# Altium project mini-rockets.PrjPcb (part 1 of 2)
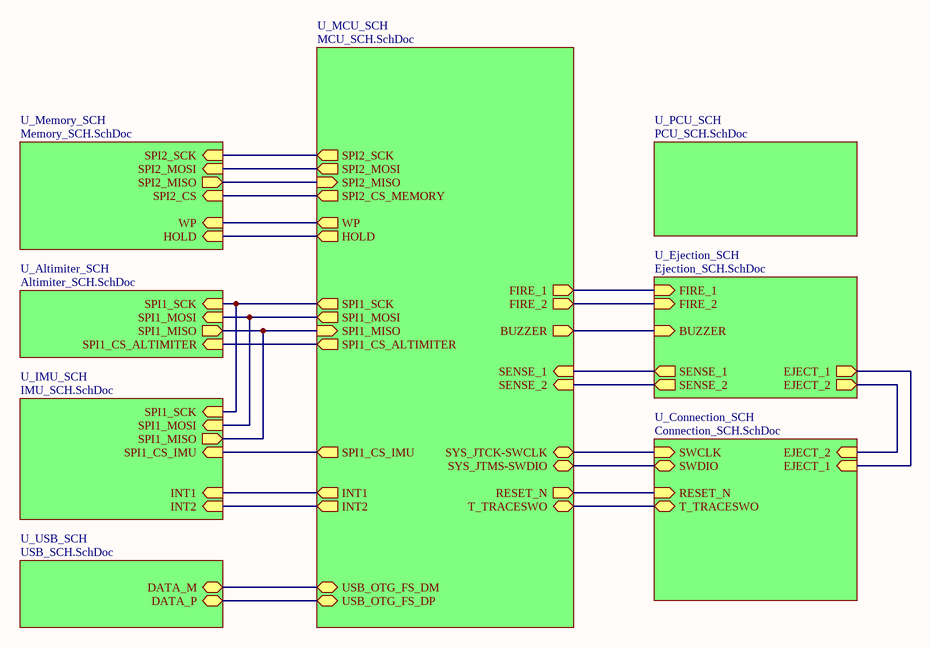
[diagram p0: TopLevel.SchDoc]
9 sheets, 83 parts. Net scope: hierarchical (ports join the sheet entries above them; power ports are global).
Board file: mini-rocket.PcbDoc
Sheets:
  TopLevel.SchDoc
    U_Altimiter_SCH = Altimiter_SCH.SchDoc
    U_MCU_SCH = MCU_SCH.SchDoc
    U_Connection_SCH = Connection_SCH.SchDoc
    U_Memory_SCH = Memory_SCH.SchDoc
    U_PCU_SCH = PCU_SCH.SchDoc
    U_Ejection_SCH = Ejection_SCH.SchDoc
    U_IMU_SCH = IMU_SCH.SchDoc
    U_USB_SCH = USB_SCH.SchDoc

## Sheet TopLevel.SchDoc
size A; SheetNumber: 1; SheetTotal: 8

### Sub-sheets
U_Altimiter_SCH = Altimiter_SCH.SchDoc: SPI1_SCK (in), SPI1_MOSI (in), SPI1_MISO (out), SPI1_CS_ALTIMITER (in)
U_Connection_SCH = Connection_SCH.SchDoc: SWCLK (in), SWDIO (bidir), T_TRACESWO (bidir), RESET_N (in), EJECT_1 (in), EJECT_2 (in)
U_Ejection_SCH = Ejection_SCH.SchDoc: SENSE_1 (out), SENSE_2 (out), EJECT_1 (out), EJECT_2 (out), FIRE_1 (in), FIRE_2 (in), BUZZER (in)
U_IMU_SCH = IMU_SCH.SchDoc: SPI1_MOSI (in), SPI1_MISO (out), SPI1_CS_IMU (in), SPI1_SCK (in), INT2 (in), INT1 (in)
U_MCU_SCH = MCU_SCH.SchDoc: RESET_N (out), USB_OTG_FS_DM (bidir), USB_OTG_FS_DP (bidir), SYS_JTMS-SWDIO (bidir), SYS_JTCK-SWCLK (bidir), SPI2_SCK (out), SPI2_MISO (in), SPI2_MOSI (out), SPI1_SCK (out), SPI1_MISO (in), SPI1_MOSI (out), WP (out), HOLD (out), INT1 (out), INT2 (out), FIRE_1 (out), FIRE_2 (out), SENSE_1 (in), SENSE_2 (in), SPI2_CS_MEMORY (out), T_TRACESWO (bidir), SPI1_CS_ALTIMITER (out), SPI1_CS_IMU (out), BUZZER (out)
U_Memory_SCH = Memory_SCH.SchDoc: SPI2_SCK (in), WP (in), HOLD (in), SPI2_MOSI (in), SPI2_MISO (out), SPI2_CS (in)
U_PCU_SCH = PCU_SCH.SchDoc: no entries
U_USB_SCH = USB_SCH.SchDoc: DATA_M (bidir), DATA_P (bidir)

### Nets
BUZZER: sheet U_MCU_SCH/BUZZER, sheet U_Ejection_SCH/BUZZER
D_N: sheet U_MCU_SCH/USB_OTG_FS_DM, sheet U_USB_SCH/DATA_M
D_P: sheet U_MCU_SCH/USB_OTG_FS_DP, sheet U_USB_SCH/DATA_P
EJECT_1: sheet U_Connection_SCH/EJECT_1, sheet U_Ejection_SCH/EJECT_1
EJECT_2: sheet U_Connection_SCH/EJECT_2, sheet U_Ejection_SCH/EJECT_2
FIRE_1: sheet U_MCU_SCH/FIRE_1, sheet U_Ejection_SCH/FIRE_1
FIRE_2: sheet U_MCU_SCH/FIRE_2, sheet U_Ejection_SCH/FIRE_2
HOLD: sheet U_MCU_SCH/HOLD, sheet U_Memory_SCH/HOLD
INT1: sheet U_MCU_SCH/INT1, sheet U_IMU_SCH/INT1
INT2: sheet U_MCU_SCH/INT2, sheet U_IMU_SCH/INT2
RESET_N: sheet U_MCU_SCH/RESET_N, sheet U_Connection_SCH/RESET_N
SENSE_1: sheet U_MCU_SCH/SENSE_1, sheet U_Ejection_SCH/SENSE_1
SENSE_2: sheet U_MCU_SCH/SENSE_2, sheet U_Ejection_SCH/SENSE_2
SPI1_CS_ALTIMITER: sheet U_Altimiter_SCH/SPI1_CS_ALTIMITER, sheet U_MCU_SCH/SPI1_CS_ALTIMITER
SPI1_CS_IMU: sheet U_MCU_SCH/SPI1_CS_IMU, sheet U_IMU_SCH/SPI1_CS_IMU
SPI1_MISO: sheet U_Altimiter_SCH/SPI1_MISO, sheet U_MCU_SCH/SPI1_MISO, sheet U_IMU_SCH/SPI1_MISO
SPI1_MOSI: sheet U_Altimiter_SCH/SPI1_MOSI, sheet U_MCU_SCH/SPI1_MOSI, sheet U_IMU_SCH/SPI1_MOSI
SPI1_SCK: sheet U_Altimiter_SCH/SPI1_SCK, sheet U_MCU_SCH/SPI1_SCK, sheet U_IMU_SCH/SPI1_SCK
SPI2_CS: sheet U_MCU_SCH/SPI2_CS_MEMORY, sheet U_Memory_SCH/SPI2_CS
SPI2_MISO: sheet U_MCU_SCH/SPI2_MISO, sheet U_Memory_SCH/SPI2_MISO
SPI2_MOSI: sheet U_MCU_SCH/SPI2_MOSI, sheet U_Memory_SCH/SPI2_MOSI
SPI2_SCK: sheet U_MCU_SCH/SPI2_SCK, sheet U_Memory_SCH/SPI2_SCK
SWCLK: sheet U_MCU_SCH/SYS_JTCK-SWCLK, sheet U_Connection_SCH/SWCLK
SWDIO: sheet U_MCU_SCH/SYS_JTMS-SWDIO, sheet U_Connection_SCH/SWDIO
T_TRACESWO: sheet U_MCU_SCH/T_TRACESWO, sheet U_Connection_SCH/T_TRACESWO
WP: sheet U_MCU_SCH/WP, sheet U_Memory_SCH/WP

## Sheet Altimiter_SCH.SchDoc
size A; SheetNumber: 5; SheetTotal: 9
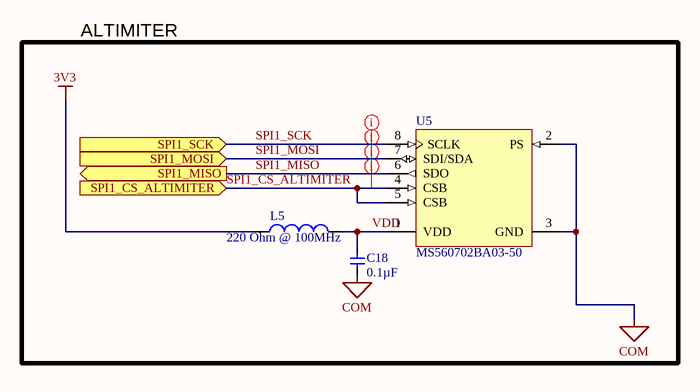
[diagram p1: Altimiter_SCH.SchDoc]

### Parts
C18  Capacitance: 0.1µF  [C0603]  (hidden comment: GRM188R71C104KA01D)
L5  Impedance @ Frequency: 220 Ohm @ 100MHz  [L0805]  (hidden comment: BLM21PG221SN1D)
U5  MS560702BA03-50  [TECO-MS560702BA03-50_V]

### Blocks framed on the sheet
ALTIMITER: C18 L5 U5

### Ports
SPI1_CS_ALTIMITER (in), SPI1_MISO (out), SPI1_MOSI (in), SPI1_SCK (in)

### Nets
3V3: L5.1
COM: C18.2 U5.2(PS) U5.3(GND)
SPI1_CS_ALTIMITER: U5.4(CSB) U5.5(CSB) ; port SPI1_CS_ALTIMITER
SPI1_MISO: U5.6(SDO) ; port SPI1_MISO
SPI1_MOSI: U5.7(SDI/SDA) ; port SPI1_MOSI
SPI1_SCK: U5.8(SCLK) ; port SPI1_SCK
VDD: C18.1 L5.2 U5.1(VDD)

### Layout directives
net class 50_Ohm: SPI1_CS_ALTIMITER, SPI1_MISO, SPI1_MOSI, SPI1_SCK

### Library data of the parts
C18 = GRM188R71C104KA01D: CAP CER 0.1UF 16V 10% X7R 0603; ComponentLink1Description: Datasheet; ComponentLink1URL: http://search.murata.co.jp/Ceramy/image/img/A01X/G101/ENG/GRM188R71C104KA01-01.pdf; ComponentLink2URL: http://media.digikey.com/photos/Murata%20Photos/0603%20Murata%20MLCC%20Caps.jpg; ComponentLink2Description: Photo; Pricing 1: 1=0.13 (USD); Tolerance: ±10%; Operating Temperature: -55°C ~ 125°C; Applications: General Purpose; Supplier 1: Digi-Key; Supplier Part Number 1: 490-1532-1-ND; Temperature Coefficient: X7R; Voltage - Rated: 16V
L5 = BLM21PG221SN1D: FERRITE CHIP 220 OHM 0805; Current Rating: 2A; DC Resistance (DCR): 45 mOhm Max; Filter Type: Differential Mode - Single; Supplier 1: Digi-Key; Supplier Part Number 1: 490-1054-1-ND; ComponentLink1URL: http://search.murata.co.jp/Ceramy/image/img/PDF/ENG/L0110S0100BLM21P.pdf; ComponentLink1Description: datasheet; ComponentLink2URL: http://media.digikey.com/photos/Murata%20Photos/BLM21%20SERIES%200805.jpg; ComponentLink2Description: photo
U5 = CMP-2000-07512-1: Barometric Pressure Sensor, with Stainless Steel Cap , 1.8 to 3.6 V, -40 to 85 degC, 8-Pin SMD, RoHS, Tape and Reel; Manufacturer: TE Connectivity; Lead Free: LeadFree; RoHSCompliant: false; Mounting Technology: SurfaceMount; Datasheet URL: http://www.te.com/commerce/DocumentDelivery/DDEController?Action=showdoc&DocId=Data+Sheet%7FMS5607-02BA03%7FB2%7Fpdf%7FEnglish%7FENG_DS_MS5607-02BA03_B2.pdf%7FMS560702BA03-50; Manufacturer URL: http://www.te.com/; Package Description: 8-Pin Surface Mount Device, Body 3 x 5 mm, Pitch 1.25 mm; Package Reference: MS560702BA03-50; Datasheet Version: 06/2017

## Sheet MCU_SCH.SchDoc
size B; SheetNumber: 3; SheetTotal: 9; SPICEModelCacheGSGSOODR: <root> / <DocumentId>GSGSOODR</DocumentId> / <CacheFrame Number="0"> / <Model Name="lmk107b7225_a-tr" Kind="CKT"> / <Text>* LMK107B7225_A-TR     SPICE MODEL  ( General Type ) / *-------------------------------------------------------------------------------------------------------- / * Model Generated by TAIYO YUDEN Corporation (http://www.ty-top.com) / * Version 1.0 / * TAIYO YUDEN Control No. 170508_100817 / * Copyright(c) 2012 TAIYO YUDEN CO.,LTD. All Rights Reserved. / *-------------------------------------------------------------------------------------------------------- / * / * Products Name : Multilayer Ceramic Capacitors / * / * Characteristics : / *     Capacitance : 2.2 uF , Rated Voltage : 10V , TCC : X7R / *     Case Size : 1.6 x 0.8 / 0.063 x 0.031 [mm/inch] , Thickness : 0.8 / 0.031 [mm/inch] / *     (Conditions: Temperature = 25 degC , DC Bias Current/Voltage = 0A / 0V) / * / * Frequency Range : 40Hz - 3GHz / * / * External Node Assignments : / * / *  1  o---| |---o  2 / * / *-------------------------------------------------------------------------------------------------------- / .SubCkt LMK107B7225_A-TR 1 2 / **************************** / C0 1 110 1.6448u / Cm 1 101 0.35593u / C1 101 102 0.58122u / Rc1 101 102 1.399k / C2 102 103 0.16803u / Rc2 102 103 145.45 / C3 103 110 0.093029u / Rc3 103 110 10.174 / C2m 1 301 0.50048u / C21 301 302 1.5848u / Rc21 301 302 3.55k / C22 302 303 1.5193u / Rc22 302 303 3.3641k / C23 303 304 2.179u / Rc23 303 304 2.1549k / C24 304 305 0.86851u / Rc24 304 305 215.54 / C25 305 306 0.87682u / Rc25 305 306 159.72 / C26 306 307 1.7101u / Rc26 306 307 4.7719 / C27 307 308 0.6214u / Rc27 307 308 12.394 / C28 308 309 0.643u / Rc28 308 309 10.101 / C29 309 110 5422p / Rc29 309 110 0.99109 / Rp0 1 110 45.4545454545455Meg / L0 110 120 0.23321n / Lm 120 130 0.16586n / L1 120 121 0.12676n / RL1 121 130 86.335m / L2 120 122 0.61599n / RL2 122 130 0.38949 / L3 120 123 0.67084n / RL3 123 130 0.43251 / CR 120 124 0.12415u / LR 124 125 0.46265n / RR 125 130 72.926m / CL 130 140 1.3749p / LL 130 140 0.23217n / RL 130 140 32.536 / Rs 140 2 6.8187m / **************************** / .ends LMK107B7225_A-TR</Text> / </Model> / </CacheFrame> / </root>
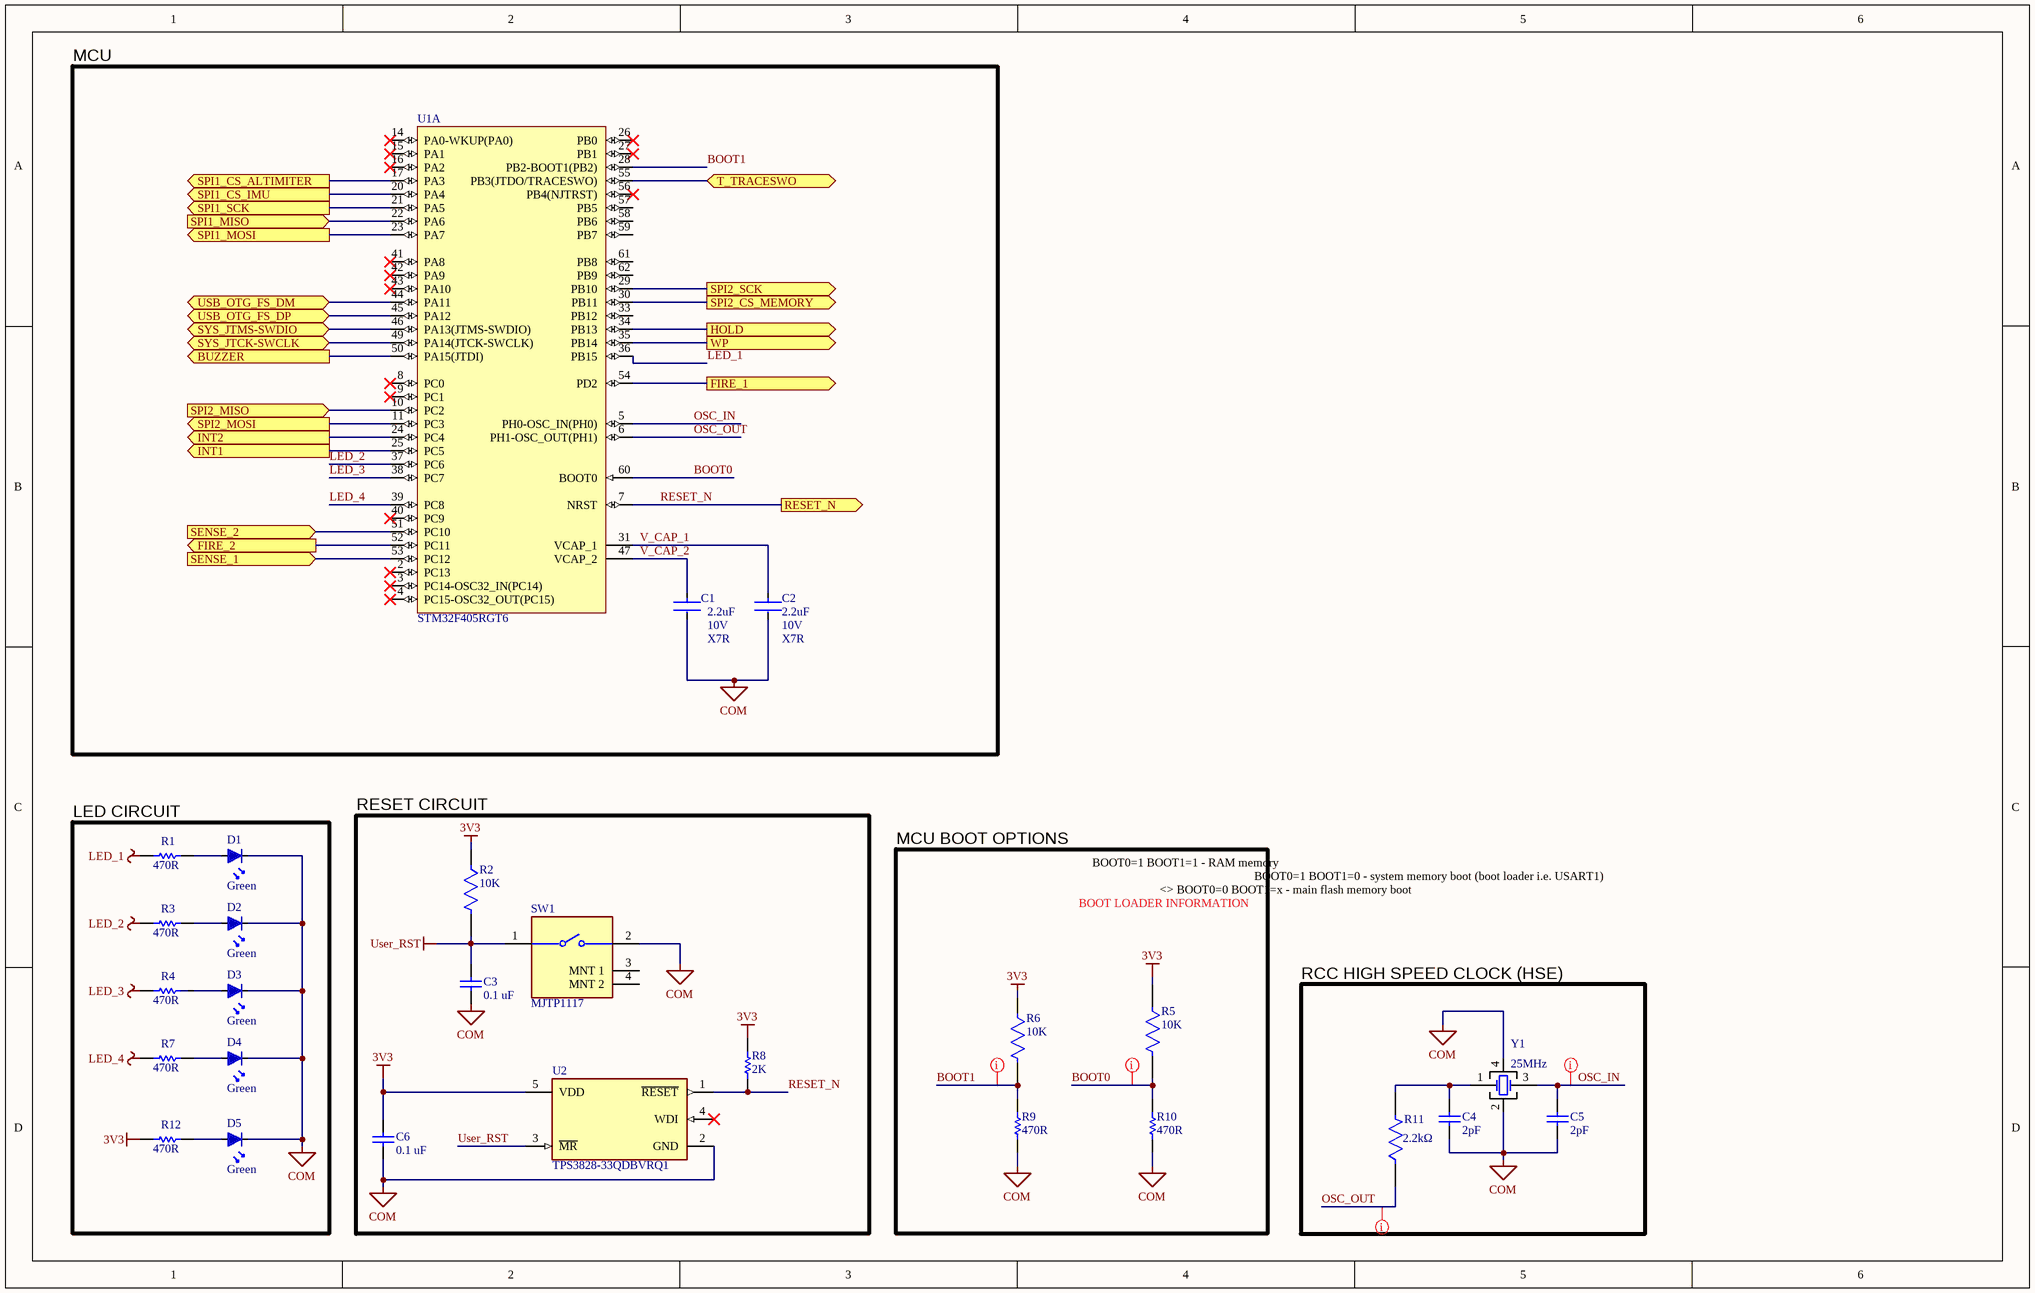
[diagram p2: MCU_SCH.SchDoc]

### Parts
C1  Dielectric: X7R  Voltage Rating: 10V  Capacitance: 2.2uF  [FP-0603-L_1_6_0_1-W_0_8_0-IPC_C]  (hidden comment: LMK107B7225KA-TR)
C2  Dielectric: X7R  Voltage Rating: 10V  Capacitance: 2.2uF  [FP-0603-L_1_6_0_1-W_0_8_0-IPC_C]  (hidden comment: LMK107B7225KA-TR)
C3  0.1 uF  [MURA-0603_H_0.9_M]
C4  2pF  [CAPC1608X92X38LL15T08]
C5  2pF  [CAPC1608X92X38LL15T08]
C6  0.1 uF  [MURA-0603_H_0.9_M]
D1  Color: Green  [D0805]  (hidden comment: SML-LXR85GC-TR)
D2  Color: Green  [D0805]  (hidden comment: SML-LXR85GC-TR)
D3  Color: Green  [D0805]  (hidden comment: SML-LXR85GC-TR)
D4  Color: Green  [D0805]  (hidden comment: SML-LXR85GC-TR)
D5  Color: Green  [D0805]  (hidden comment: SML-LXR85GC-TR)
R1  470R  [RESC1608X55X30NL15T15]
R2  10K  [FP-ERJ3G-IPC_C]
R3  470R  [RESC1608X55X30NL15T15]
R4  470R  [RESC1608X55X30NL15T15]
R5  10K  [FP-ERJ3G-IPC_C]
R6  10K  [FP-ERJ3G-IPC_C]
R7  470R  [RESC1608X55X30NL15T15]
R8  2K  [RESC1608X55X30LL15T15]
R9  470R  [RESC1608X55X30NL15T15]
R10  470R  [RESC1608X55X30NL15T15]
R11  Resistance: 2.2kΩ  [FP-ERJ3G-MFG]  (hidden comment: ERJ-3GEYJ222V)
R12  470R  [RESC1608X55X30NL15T15]
SW1  MJTP1117  [FP-MJTP1117-MFG]
U1  STM32F405RGT6  [STM-LQFP64_M]  (part A of 2)
U2  TPS3828-33QDBVRQ1  [FP-DBV0005A-IPC_C]
Y1  Frequency: 25MHz  [ECS - 4-SMD, No Lead]  (hidden comment: 490-18333-1-ND)

### Blocks framed on the sheet
MCU: C1 C2 U1
LED CIRCUIT: D1-D5 R1 R3 R4 R7 R12
RESET CIRCUIT: C3 C6 R2 R8 SW1 U2
MCU BOOT OPTIONS: R5 R6 R9 R10
RCC HIGH SPEED CLOCK (HSE): C4 C5 R11 Y1

### Ports
BUZZER (out), FIRE_1 (out), FIRE_2 (out), HOLD (out), INT1 (out), INT2 (out), RESET_N (out), SENSE_1 (in), SENSE_2 (in), SPI1_CS_ALTIMITER (out), SPI1_CS_IMU (out), SPI1_MISO (in), SPI1_MOSI (out), SPI1_SCK (out), SPI2_CS_MEMORY (out), SPI2_MISO (in), SPI2_MOSI (out), SPI2_SCK (out), SYS_JTCK-SWCLK (bidir), SYS_JTMS-SWDIO (bidir), T_TRACESWO (bidir), USB_OTG_FS_DM (bidir), USB_OTG_FS_DP (bidir), WP (out)

### Nets
3V3: C6.2 R2.1 R5.1 R6.1 R8.2 R12.1 U2.5(VDD)
COM: C1.2 C2.2 C3.1 C4.2 C5.2 C6.1 D1.K D2.K D3.K D4.K D5.K R9.1 R10.1 SW1.2 U2.2(GND) Y1.2 Y1.4
LED_1: R1.1 U1.36(PB15)
LED_2: R3.1 U1.37(PC6)
LED_3: R4.1 U1.38(PC7)
LED_4: R7.1 U1.39(PC8)
User_RST: C3.2 R2.2 SW1.1 U2.3(~{MR})
BOOT0: R5.2 R10.2 U1.60(BOOT0)
BOOT1: R6.2 R9.2 U1.28(PB2-BOOT1(PB2))
BUZZER: U1.50(PA15(JTDI)) ; port BUZZER
D_N: U1.44(PA11) ; port USB_OTG_FS_DM
D_P: U1.45(PA12) ; port USB_OTG_FS_DP
FIRE_1: U1.54(PD2) ; port FIRE_1
FIRE_2: U1.52(PC11) ; port FIRE_2
HOLD: U1.34(PB13) ; port HOLD
INT1: U1.25(PC5) ; port INT1
INT2: U1.24(PC4) ; port INT2
OSC_IN: C5.1 U1.5(PH0-OSC_IN(PH0)) Y1.3(OSC2)
OSC_OUT: R11.1 U1.6(PH1-OSC_OUT(PH1))
RESET_N: R8.1 U1.7(NRST) U2.1(~{RESET}) ; port RESET_N
SENSE_1: U1.53(PC12) ; port SENSE_1
SENSE_2: U1.51(PC10) ; port SENSE_2
SPI1_CS_ALTIMITER: U1.17(PA3) ; port SPI1_CS_ALTIMITER
SPI1_CS_IMU: U1.20(PA4) ; port SPI1_CS_IMU
SPI1_MISO: U1.22(PA6) ; port SPI1_MISO
SPI1_MOSI: U1.23(PA7) ; port SPI1_MOSI
SPI1_SCK: U1.21(PA5) ; port SPI1_SCK
SPI2_CS: U1.30(PB11) ; port SPI2_CS_MEMORY
SPI2_MISO: U1.10(PC2) ; port SPI2_MISO
SPI2_MOSI: U1.11(PC3) ; port SPI2_MOSI
SPI2_SCK: U1.29(PB10) ; port SPI2_SCK
SWCLK: U1.49(PA14(JTCK-SWCLK)) ; port SYS_JTCK-SWCLK
SWDIO: U1.46(PA13(JTMS-SWDIO)) ; port SYS_JTMS-SWDIO
T_TRACESWO: U1.55(PB3(JTDO/TRACESWO)) ; port T_TRACESWO
V_CAP_1: C2.1 U1.31(VCAP_1)
V_CAP_2: C1.1 U1.47(VCAP_2)
WP: U1.35(PB14) ; port WP
NetC4_1: C4.1 R11.2 Y1.1(OSC1)
NetD1_A: D1.A R1.2
NetD2_A: D2.A R3.2
NetD3_A: D3.A R4.2
NetD4_A: D4.A R7.2
NetD5_A: D5.A R12.2

Not connected (* = marked no-connect by the designer): SW1 3(MNT_1) 4(MNT_2); U1 2(PC13)* 3(PC14-OSC32_IN(PC14))* 4(PC15-OSC32_OUT(PC15))* 8(PC0)* 9(PC1)* 14(PA0-WKUP(PA0))* 15(PA1)* 16(PA2)* 26(PB0)* 27(PB1)* 33(PB12) 40(PC9)* 41(PA8)* 42(PA9)* 43(PA10)* 56(PB4(NJTRST))* 57(PB5) 58(PB6) 59(PB7) 61(PB8) 62(PB9); U2 4(WDI)*

### Layout directives
net class 50_Ohm: BOOT0, BOOT1, OSC_IN, OSC_OUT

### Notes on the sheet
- BOOT LOADER INFORMATION
- BOOT0=1 BOOT1=1 - RAM memory
- <> BOOT0=0 BOOT1=x - main flash memory boot
- BOOT0=1 BOOT1=0 - system memory boot (boot loader i.e. USART1)

### Library data of the parts
C1 = CMP-14477-000474-2: CAP CER 2.2UF 10V X7R 0603; Tolerance: 10%; RoHS Compliant: Yes; Min Operating Temperature: -55°C; Width: 0.031inch; Packaging: Tape and Reel; Termination: Wraparound; Case/Package: 0603; Halogen Free: Halogen Free; Mount: Surface Mount; Thickness: 0.035inch; Length: 0.063inch; Voltage Rating (DC): 10V; Max Operating Temperature: 125°C
C2 = CMP-14477-000474-2: None; Tolerance: 10%; RoHS Compliant: Yes; Min Operating Temperature: -55°C; Width: 0.031inch; Packaging: Tape and Reel; Termination: Wraparound; Case/Package: 0603; Halogen Free: Halogen Free; Mount: Surface Mount; Thickness: 0.035inch; Length: 0.063inch; Voltage Rating (DC): 10V; Max Operating Temperature: 125°C
C3 = CMP-2000-05253-1: CAP, Ceramic, 0.1 uF, 10%, 16 V, 0603, RoHS, Tape and Reel; Manufacturer: Murata; Capacitance - pF: 100000pF; Case Length: 1.6mm; Voltage Rating DC: 16V; Brand: MurataElectronics; Temperature Coefficient / Code: +/-15%; Case Width: 0.8mm; Type: GeneralPurposeMLCC; Capacitance: 0.1uF; Dielectric: X7R; Capacitance - nF: 100nF; Product Category: MultilayerCeramicCapacitorsMLCC-SMD/SMT; Datasheet URL: https://datasheet.ciiva.com/29202/451467-da-01-en-vs-kondensator-0603-29202287.pdf; Termination Style: SMD/SMT; Operating Temperature Range: -55Cto+125C; Case Code - in: 0603; Datasheet Version: Dec-10; Dimensions: 0.8mmWx1.6mmLx0.8mmH; RoHS: Details; Case Code - mm: 1608; Product: GeneralTypeMLCCs; Voltage Rating: 16V; Package / Case: 0603(1608metric); Factory Pack Quantity: 4000; Packaging: Reel; Maximum Operating Temperature: +125C; Manufacturer URL: http://www.murata.com/; Case Height: 0.8mm; Minimum Operating Temperature: -55C; Series: GRM; Tolerance: 10%
C4 C5 = CMP-2006-01521-1: VJ0603D471KXXAJ CAP CER 2PF 50V C0G/NP0 0603; Manufacturer: Vitramon; Part Number: VJ0603D471KXXAJ
C6 = CMP-2000-05253-1: CAP, Ceramic, 0.1 uF, 10%, 16 V, 0603, RoHS, Tape and ReelGRM188R71C104KA01D / Replaced by:  C0603C104K4RAC7081; Manufacturer: Murata; Capacitance - pF: 100000pF; Case Length: 1.6mm; Voltage Rating DC: 16V; Brand: MurataElectronics; Temperature Coefficient / Code: +/-15%; Case Width: 0.8mm; Type: GeneralPurposeMLCC; Capacitance: 0.1uF; Dielectric: X7R; Capacitance - nF: 100nF; Product Category: MultilayerCeramicCapacitorsMLCC-SMD/SMT; Datasheet URL: https://datasheet.ciiva.com/29202/451467-da-01-en-vs-kondensator-0603-29202287.pdf; Termination Style: SMD/SMT; Operating Temperature Range: -55Cto+125C; Case Code - in: 0603; Datasheet Version: Dec-10; Dimensions: 0.8mmWx1.6mmLx0.8mmH; RoHS: Details; Case Code - mm: 1608; Product: GeneralTypeMLCCs; Voltage Rating: 16V; Package / Case: 0603(1608metric); Factory Pack Quantity: 4000; Packaging: Reel; Maximum Operating Temperature: +125C; Manufacturer URL: http://www.murata.com/; Case Height: 0.8mm; Minimum Operating Temperature: -55C; Series: GRM; Tolerance: 10%
D1-D5 = SML-LXR85GC-TR: LED RA 565NM GREEN WTR CLR SMD 0805; Voltage - DC Reverse (Vr) (Max): 5V; Voltage - Forward (Vf) (Typ): 2.2V; Current - Test: 20mA; Viewing Angle: 130°; Millicandela Rating: 12mcd; Lens Style/Size: Rectangle with Domed Top; Lens Color: Colorless; Lens Transparency: Clear; ComponentLink1Description: Datasheet; ComponentLink1URL: http://www.lumex.com/specs/SML-LXR85GC-TR.pdf; ComponentLink2URL: http://media.digikey.com/photos/Lumex%20Photos/Fig%2012%20T052%201546.jpg; ComponentLink2Description: Photo; Wavelength - Peak: 565nm; Supplier 1: Digi-Key; Supplier Part Number 1: 67-1557-1-ND
R1 = CMP-2000-00795-1: 470 Ohm ERJ-3GEYJ471V; Manufacturer: Panasonic; Part Number: ERJ-3GEYJ471V
R2 = CMP-2000-00704-2: RES SMD 10K OHM 5% 1/10W 0603; Temperature Coefficient: 200ppm/°C; Max Power Dissipation: 100mW; Resistance: 10kR; Voltage Rating (DC): 50V; Voltage Rating: 75V; Resistor Type: Thick Film; Tolerance: 5%; Military Standard: Not; Package Quantity: 1; Max Operating Temperature: 155°C; Mount: Surface Mount; Technology: THICK FILM; Case/Package: 0603; Construction: Rectangular; Depth: 0.8mm; Case Code (Imperial): 0603; Weight: 7.1E-05oz; Features: Automotive AEC-Q200; Packaging: Tape and Reel; Width: 0.8mm; Length: 1.6mm; Termination: SMD/SMT; Power Rating: 100mW; Lead Free: Lead Free; Number of Terminations: 2; Height: 0.45mm; RoHS Compliant: Yes; Min Operating Temperature: -55°C; Contact Plating: Tin; REACH SVHC: No SVHC; Resistance Tolerance: 5%; Series: ERJ; Working Voltage: 75V; Case Code (Metric): 1608
R3 R4 R7 R9 R10 R12 = CMP-2000-00795-1: ERJ-3GEYJ471V; Manufacturer: Panasonic; Part Number: ERJ-3GEYJ471V
R5 R6 = CMP-2000-00704-2: RES SMD 10K OHM 5% 1/10W 0603 ERJ-3GEYJ103V; Temperature Coefficient: 200ppm/°C; Max Power Dissipation: 100mW; Resistance: 10kR; Voltage Rating (DC): 50V; Voltage Rating: 75V; Resistor Type: Thick Film; Tolerance: 5%; Military Standard: Not; Package Quantity: 1; Max Operating Temperature: 155°C; Mount: Surface Mount; Technology: THICK FILM; Case/Package: 0603; Construction: Rectangular; Depth: 0.8mm; Case Code (Imperial): 0603; Weight: 7.1E-05oz; Features: Automotive AEC-Q200; Packaging: Tape and Reel; Width: 0.8mm; Length: 1.6mm; Termination: SMD/SMT; Power Rating: 100mW; Lead Free: Lead Free; Number of Terminations: 2; Height: 0.45mm; RoHS Compliant: Yes; Min Operating Temperature: -55°C; Contact Plating: Tin; REACH SVHC: No SVHC; Resistance Tolerance: 5%; Series: ERJ; Working Voltage: 75V; Case Code (Metric): 1608
R8 = CMP-2000-00741-1: ERJ-3GEYJ202V; Manufacturer: Panasonic; Part Number: ERJ-3GEYJ202V
R11 = CMP-2000-00747-2: RES SMD 2.2K OHM 5% 1/10W 0603; Manufacturer: Panasonic; Power Rating: 0.1W; Automotive Grade: Grade 0; Temperature Coefficient: 200ppm/°C; Voltage Rating: 75V; Value: 2.2kΩ; Digikey Description: RES SMD 2.2K OHM 5% 1/10W 0603; Composition: Thick Film; Footprint Url: https://industrial.panasonic.com/cdbs/www-data/pdf/RDA0000/DMA0000COL17.pdf; Temperature: -55°C to +155°C; Temperature Range High: +155°C; Package: ERJ3G; RoHS: TRUE; Lead Free: Yes; Tolerance: 5%; ComponentLink2URL: https://industrial.panasonic.com/cdbs/www-data/pdf/RDA0000/AOA0000C301.pdf; Series: ERJ; Device Class L2: Resistors; Device Class L3: Chip SMD Resistors; Height: 0.55mm; Manufacturer Part Number: ERJ-3GEYJ222V; Temperature Range Low: -55°C; ComponentLink2Description: Datasheet; Octopart: https://octopart.com/erj-3geyj222v-panasonic-55422038; Category: Res; Automotive: Yes; Mouser Description: Thick Film Resistors - SMD 0603 2.2Kohms 5% AEC-Q200; Device Class L1: Passive Components
SW1 = CMP-47024-000001-1: SWITCH TACTILE SPST-NO 0.05A 12V; Manufacturer: Apem Inc.; Contact Resistance: 500mΩ; Contact Current Rating: 50mA; Operating Force: 160gf; Electromechanical Life: 100000Cycles; Mount: Through Hole; RoHS: TRUE; Height: 0.169inch; ComponentLink2URL: https://www.apem.com/int/index.php?controller=attachment&id_attachment=876; Device Class L3: Tactile Switches; Octopart: https://octopart.com/mjtp1117-apem-6499265; Mouser Description: Switch Tactile N.O. SPST Rectangular Button PC Pins 0.05A 12VDC 1.57N Thru-Hole Bulk; Digikey Description: SWITCH TACTILE SPST-NO 0.05A 12V; Category: Switch; Manufacturer Part Number: MJTP1117; Temperature Range High: +70°C; Lead Free: Yes; Device Class L2: Switches; ComponentLink2Description: Datasheet; Temperature Range Low: -20°C; Throw Configuration: SPST-NO; Voltage Rating Dc: 12V; Automotive: No; Package: 0; Temperature: -20°C to +70°C; Device Class L1: Electromechanical
U1 = CMP-0243-00019-3: ARM Cortex-M4 32-bit MCU+FPU, 210 DMIPS, 1024 kB Flash, 192 kB Internal RAM, 51 I/Os, 64-pin LQFP, -40 to 85 degC, Tray; Manufacturer: STMicroelectronics; Supply Voltage(Vcc) min (V): 1.8; Supply Voltage(Vcc) max (V): 3.6; Internal RAM Size (kB): 192; I/Os (High Current): 51; D/A Converter: 2x12-bit; FLASH Size (Prog) (kB): 1024; Operating Frequency(F) (Processor speed) (MHz): 168; ComponentLink2Description: Datasheet; PackageVersion: Rev. 4, 06/2013; DatasheetVersion: Rev. 4; Core: ARM Cortex-M4; ComponentLink2URL: http://www.st.com/st-web-ui/static/active/en/resource/technical/document/datasheet/DM00037051.pdf; PackageReference: LQFP64; Packing: Tray; ComponentLink1Description: Manufacturer URL; ComponentLink3URL: http://www.st.com/st-web-ui/static/active/en/resource/technical/document/datasheet/DM00037051.pdf; ComponentLink3Description: Package Specification; Mounting Technology: Surface Mount; ComponentLink1URL: http://www.st.com/web/en/home.html; PackageDescription: 64-Pin Low Profile Quad Flat Package, 10 x 10 mm Body, 0.5 mm Pitch; PartNumber: STM32F405RGT6
U2 = CMP-04919-000035-1: IC SUPERVISOR 1 CHANNEL SOT23-5; Supply Current: 25uA; Max Supply Voltage: 5.5V; Power Dissipation: 437mW; Quiescent Current: 15uA; Reset: Active Low; Number of Elements: 1; Undervoltage Threshold: 2.93V; Max Reset Threshold Voltage: 3V; Min Supply Voltage: 1.1V; Watchdog Timer: Yes; Min Reset Threshold Voltage: 2.84V; Reset Timeout: 120ms; Packaging: Tape and Reel; Type: Simple Reset/Power-On Reset; Series: -; Max Operating Temperature: 125°C; Case/Package: SOT-23-5; REACH SVHC: No SVHC; Nominal Supply Current: 25uA; RoHS Compliant: Yes; Package Quantity: 1; Max Supply Current: 25uA; Mount: Surface Mount; Min Operating Temperature: -40°C; Threshold Voltage: 2.93V; Radiation Hardening: No; Number of Voltages Monitored: 1; Number of Pins: 5; Max Power Dissipation: 437mW; Operating Supply Current: 15uA; Overvoltage Threshold: 3V; Lead Free: Lead Free
Y1 = XRCGB25M000F0L00R0: CRYSTAL 25.0000MHZ 6PF SMD; Frequency Stability: ±50ppm; Load Capacitance: 8pF; ESR (Equivalent Series Resistance): 50 Ohm; Operating Temperature: -10°C ~ 70°C; Type: MHz Crystal; Frequency Tolerance: ±50ppm; Series: NX5032GA; Supplier 1: Digi-Key

## Sheet Connection_SCH.SchDoc
size A; SheetNumber: 5; SheetTotal: 8
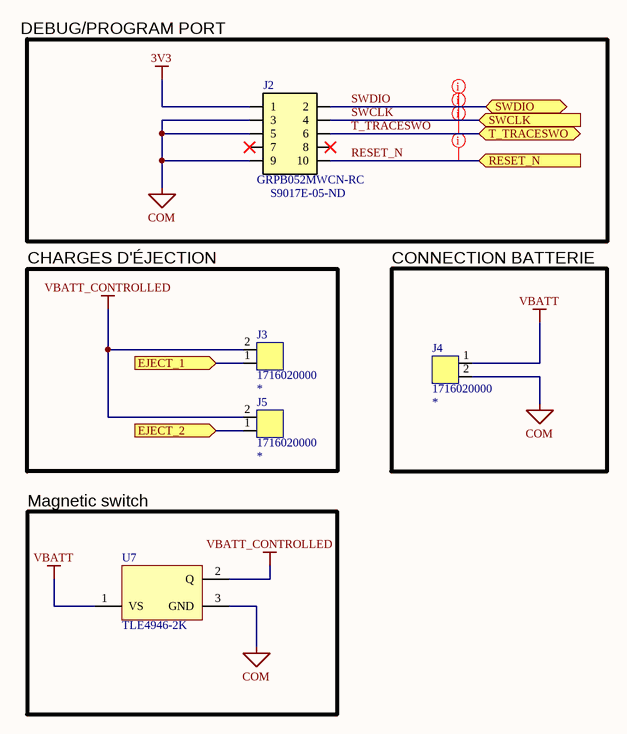
[diagram p3: Connection_SCH.SchDoc]

### Parts
J2  GRPB052MWCN-RC  Supplier Part Number 1: S9017E-05-ND  [HEADER 50MIL 10POS MALE]
J3  1716020000  [1716020000]
J4  1716020000  [1716020000]
J5  1716020000  [1716020000]
U7  TLE4946-2K  [INF-PG-SC59_M]

### Blocks framed on the sheet
CHARGES D'ÉJECTION: J3 J5
CONNECTION BATTERIE: J4
Magnetic switch: U7

### Ports
EJECT_1 (in), EJECT_2 (in), RESET_N (in), SWCLK (in), SWDIO (bidir), T_TRACESWO (bidir)

### Nets
3V3: J2.1
COM: J2.3 J2.5 J2.9 J4.2 U7.3(GND)
VBATT: J4.1 U7.1(VS)
VBATT_CONTROLLED: J3.2 J5.2 U7.2(Q)
EJECT_1: J3.1 ; port EJECT_1
EJECT_2: J5.1 ; port EJECT_2
RESET_N: J2.10 ; port RESET_N
SWCLK: J2.4 ; port SWCLK
SWDIO: J2.2 ; port SWDIO
T_TRACESWO: J2.6 ; port T_TRACESWO

Not connected (* = marked no-connect by the designer): J2 7* 8*

### Layout directives
net class 50_Ohm: RESET_N, SWCLK, SWDIO, T_TRACESWO

### Notes on the sheet
- DEBUG/PROGRAM PORT

### Library data of the parts
J2 = GRPB052MWCN-RC: CONN HEADER R/A 10POS 1.27MM; ComponentLink1URL: http://media.digikey.com/photos/FCI%20Photos/67996-114HLF.JPG; ComponentLink2Description: photo; Supplier 1: Digi-Key
J3-J5 = 1716020000: CONN TERM BLOCK PCB 5.08MM 2POS; Number of Levels: 1; Positions Per Level: 2; Pitch: 0.200" (5.08mm); Mating Orientation: Horizontal with Board; Current: 15A; Voltage: 300V; Wire Gauge: 14-24 AWG; Wire Termination: Screw - Clamping Yoke, Tension Sleeve; Torque - Screw: 0.4-0.5 Nm (3.5-4.4 Lb-In); Screw Thread: M2.5; ComponentLink1Description: Datasheet; ComponentLink1URL: http://media.digikey.com/pdf/Data%20Sheets/Weidmuller%20PDFs/Printed%20Circuit%20Board%20Terminals.pdf#page=14; ComponentLink2URL: http://media.digikey.com/photos/Weidmuller/1716020000.jpg; ComponentLink2Description: Photo; Pricing 1: 1=1.27, 10=1.137, 100=1.0105, 500=0.88418, 1000=0.75786 (USD); Supplier 1: Digi-Key; Mounting Type: Through Hole; Features: Interlocking (Side); Color: Black; Operating Temperature: -50°C ~ 120°C; Housing Material: Thermoplastic, Wemid; Contact Material - Plating: Copper Alloy - Tin Plated; ComponentLink3URL: http://media.digikey.com/pdf/Catalog%20Drawings/Connectors/LM%205.0-90-PCB%20LAY-v1.jpg; ComponentLink3Description: PCB Layout; Supplier Part Number 1: 281-1435-ND; Name: *
U7 = CMP-1148-00006-1: High Precision Hall Effect Latch, PG-SC59, Reel, Green; Manufacturer: Infineon; Brp (25degreesC) typ: -2Â mT; Target Application: Automotive; Interface: open collector; Chopped Hall Technology: TRUE; Bhyst (25degreesC) max: 4Â mT; Direction Detection: FALSE; Bop (25degreesC) min: 2Â mT; ComponentLink3URL: http://www.infineon.com/dgdl/SC59-Package_Overview.pdf?folderId=db3a30431936bc4b01194dc0d34440b0&fileId=db3a30431936bc4b01194dd1aa1d40cf; PackageReference: PG-SC59; ComponentLink1URL: http://www.infineon.com/; Type: Latch; Packing: Reel; PartNumber: TLE4946-2K; Mounting Technology: Surface Mount; ComponentLink2URL: http://www.infineon.com/dgdl/TLE4946-2K_DS_Rev1.pdf?folderId=db3a30431f848401011facc1c83b4674&fileId=db3a30431f848401011fbc925c48637f; DatasheetVersion: Rev. 1.0; PackageVersion: Mar-08; PackageDescription: 3-Pin Semiconductor Package, 3 x 1.53 mm Body, 0.95 mm Pitch; ComponentLink3Description: Package Specification; ComponentLink1Description: Manufacturer URL; ComponentLink2Description: Datasheet; Green: TRUE

## Sheet Memory_SCH.SchDoc
size A; SheetNumber: 4; SheetTotal: 9
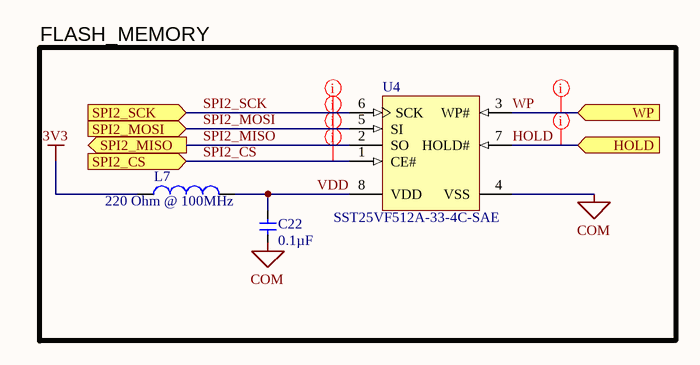
[diagram p4: Memory_SCH.SchDoc]

### Parts
C22  Capacitance: 0.1µF  [C0603]  (hidden comment: GRM188R71C104KA01D)
L7  Impedance @ Frequency: 220 Ohm @ 100MHz  [L0805]  (hidden comment: BLM21PG221SN1D)
U4  SST25VF512A-33-4C-SAE  [MCHP-SOIC-SA8_N]

### Blocks framed on the sheet
FLASH_MEMORY: C22 L7 U4

### Ports
HOLD (in), SPI2_CS (in), SPI2_MISO (out), SPI2_MOSI (in), SPI2_SCK (in), WP (in)

### Nets
3V3: L7.1
COM: C22.2 U4.4(VSS)
HOLD: U4.7(HOLD#) ; port HOLD
SPI2_CS: U4.1(CE#) ; port SPI2_CS
SPI2_MISO: U4.2(SO) ; port SPI2_MISO
SPI2_MOSI: U4.5(SI) ; port SPI2_MOSI
SPI2_SCK: U4.6(SCK) ; port SPI2_SCK
VDD: C22.1 L7.2 U4.8(VDD)
WP: U4.3(WP#) ; port WP

### Layout directives
net class 50_Ohm: HOLD, SPI2_CS, SPI2_MISO, SPI2_MOSI, SPI2_SCK, WP

### Library data of the parts
C22 = GRM188R71C104KA01D: CAP CER 0.1UF 16V 10% X7R 0603; ComponentLink1Description: Datasheet; ComponentLink1URL: http://search.murata.co.jp/Ceramy/image/img/A01X/G101/ENG/GRM188R71C104KA01-01.pdf; ComponentLink2URL: http://media.digikey.com/photos/Murata%20Photos/0603%20Murata%20MLCC%20Caps.jpg; ComponentLink2Description: Photo; Pricing 1: 1=0.13 (USD); Tolerance: ±10%; Operating Temperature: -55°C ~ 125°C; Applications: General Purpose; Supplier 1: Digi-Key; Supplier Part Number 1: 490-1532-1-ND; Temperature Coefficient: X7R; Voltage - Rated: 16V
L7 = BLM21PG221SN1D: as L5 on sheet Altimiter_SCH; Supplier 1: Digi-Key; Supplier Part Number 1: 490-1054-1-ND; ComponentLink1URL: http://search.murata.co.jp/Ceramy/image/img/PDF/ENG/L0110S0100BLM21P.pdf; ComponentLink1Description: datasheet; ComponentLink2URL: http://media.digikey.com/photos/Murata%20Photos/BLM21%20SERIES%200805.jpg; ComponentLink2Description: photo
U4 = CMP-0378-00091-1: 512 Kbit SPI Serial Flash, 2.7 to 3.6 V, 33 MHz, 0 to 70 degC, 8-pin SOIC (SA8), Tube; Manufacturer: Microchip; PackageDescription: 8-Lead Plastic Small Outline, 4.9 x 3.9 mm Body, 1.27 mm Pitch; ComponentLink1URL: http://www.microchip.com; ComponentLink1Description: Manufacturer URL; Code_JEDEC: MS-012; Mounting Technology: Surface Mount; PackageReference: SOIC-SA8; ComponentLink4Description: Product URL; ComponentLink3URL: http://ww1.microchip.com/downloads/en/DeviceDoc/25080A.pdf; ComponentLink2URL: http://ww1.microchip.com/downloads/en/DeviceDoc/25090A.pdf; ComponentLink2Description: Datasheet; ComponentLink4URL: http://www.microchip.com/SST25VF512A; PartNumber: SST25VF512A-33-4C-SAE; DatasheetVersion: DS25090A; ComponentLink3Description: Package Specification; PackageVersion: Rev. A

## Sheet PCU_SCH.SchDoc
size A; SheetNumber: 2; SheetTotal: 9; SPICEModelCacheEUDXTYFM: <root> / <DocumentId>EUDXTYFM</DocumentId> / <CacheFrame Number="0"> / <Model Name="jmk325b7476_mhpr" Kind="CKT"> / <Text>* JMK325B7476_MHPR     SPICE MODEL  ( General Type ) / *-------------------------------------------------------------------------------------------------------- / * Model Generated by TAIYO YUDEN Corporation (http://www.ty-top.com) / * Version 1.0 / * TAIYO YUDEN Control No. 170508_150609 / * Copyright(c) 2015 TAIYO YUDEN CO.,LTD. All Rights Reserved. / *-------------------------------------------------------------------------------------------------------- / * / * Products Name : Multilayer Ceramic Capacitors / * / * Characteristics : / *     Capacitance : 47 uF , Rated Voltage : 6.3V , TCC : X7R / *     Case Size : 3.2 x 2.5 / 0.126 x 0.098 [mm/inch] , Thickness : 2.5 / 0.098 [mm/inch] / *     (Conditions: Temperature = 25 degC , DC Bias Current/Voltage = 0A / 0V) / * / * Frequency Range : 40Hz - 3GHz / * / * External Node Assignments : / * / *  1  o---| |---o  2 / * / *-------------------------------------------------------------------------------------------------------- / .SubCkt JMK325B7476_MHPR 1 2 / **************************** / C0 1 110 39.689u / Cm 1 101 0.5586u / C1 101 102 0.22407u / Rc1 101 102 296.71 / C2 102 103 0.51762u / Rc2 102 103 80.311 / C3 103 110 0.016501u / Rc3 103 110 10.638 / C2m 1 301 6.2201u / C21 301 302 21.102u / Rc21 301 302 141.41 / C22 302 303 9.4039u / Rc22 302 303 99.198 / C23 303 304 6.3192u / Rc23 303 304 47.493 / C24 304 305 5.792u / Rc24 304 305 24.412 / C25 305 306 2.8968u / Rc25 305 306 13.6 / C26 306 307 1.7292u / Rc26 306 307 0.78802 / C27 307 308 0.91698u / Rc27 307 308 1.4134 / C28 308 309 0.28276u / Rc28 308 309 1.2618 / C29 309 110 2544.7p / Rc29 309 110 6.1962 / Rp0 1 110 2.12765957446809Meg / L0 110 120 0.19473n / Lm 120 130 0.18939n / L1 120 121 0.19199n / RL1 121 130 0.10143 / L2 120 122 0.46215n / RL2 122 130 57.618m / L3 120 123 2.0569n / RL3 123 130 168.9 / CR 120 124 3.9311u / LR 124 125 0.94748n / RR 125 130 9.6041m / CL 130 140 2.2173p / LL 130 140 0.16025n / RL 130 140 12.556 / Rs 140 2 2.1959m / **************************** / .ends JMK325B7476_MHPR</Text> / </Model> / </CacheFrame> / </root>
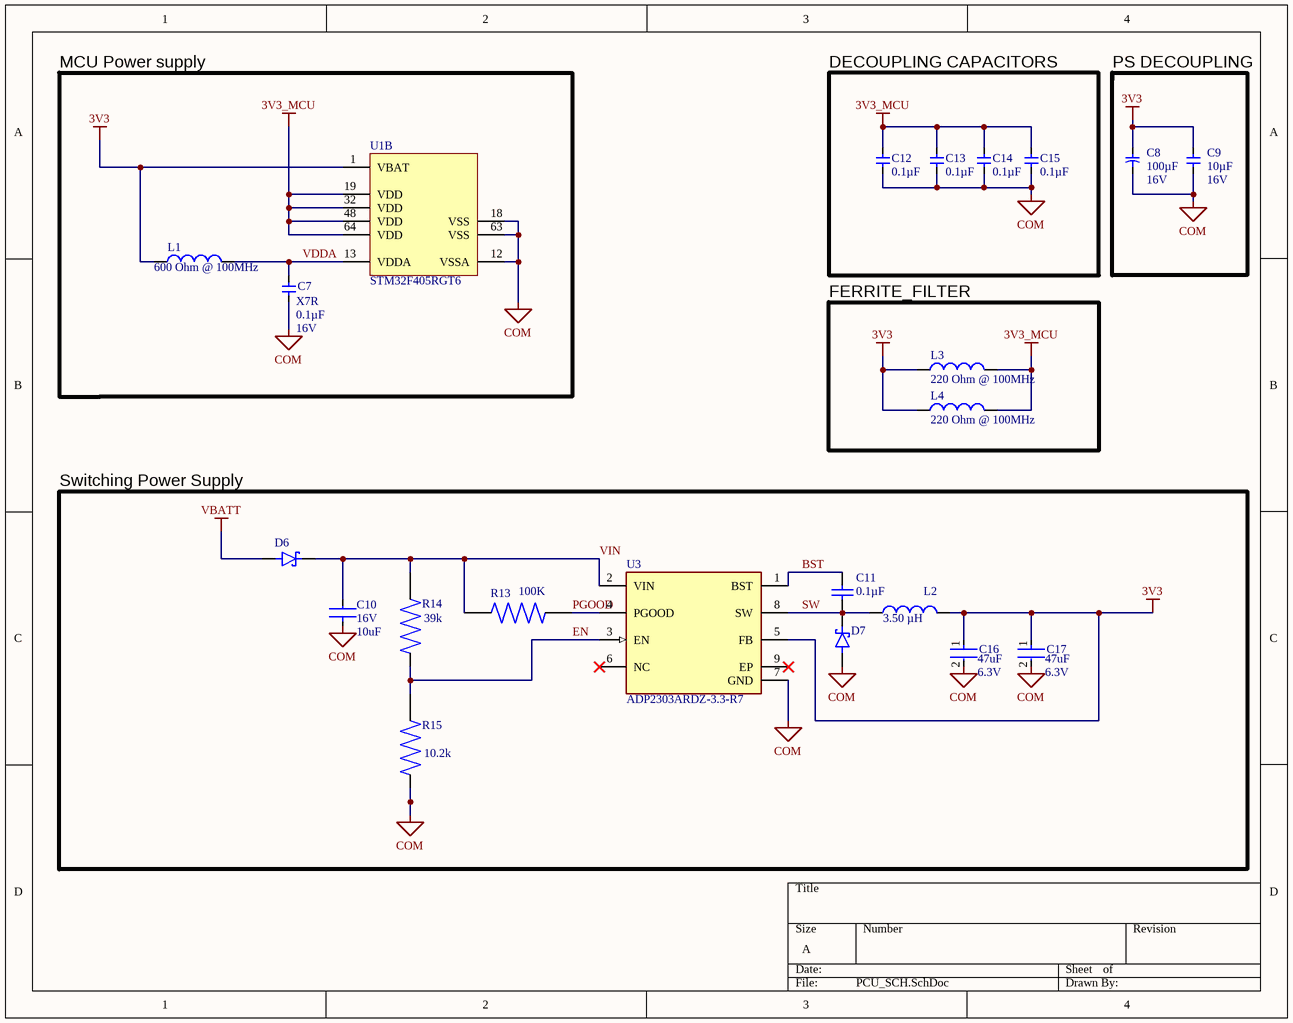
[diagram p5: PCU_SCH.SchDoc]

### Parts
C7  Temperature Coefficient: X7R  Capacitance: 0.1µF  Voltage - Rated: 16V  [C0603]  (hidden comment: GRM188R71C104KA01D)
C8  Capacitance: 100µF  Voltage Rating: 16V  [SMD J6.3]  (hidden comment: UCL1C101MCL6GS)
C9  Capacitance: 10µF  Voltage - Rated: 16V  [C0805]  (hidden comment: CL21B106KOQNNNE)
C10  Voltage Rating: 16V  Capacitance: 10uF  [C1210]  (hidden comment: GRM32ER71H106KA12L)
C11  0.1µF  [CAPC0603X33X15ML03T05]
C12  Capacitance: 0.1µF  [C0603]  (hidden comment: GRM188R71C104KA01D)
C13  Capacitance: 0.1µF  [C0603]  (hidden comment: GRM188R71C104KA01D)
C14  Capacitance: 0.1µF  [C0603]  (hidden comment: GRM188R71C104KA01D)
C15  Capacitance: 0.1µF  [C0603]  (hidden comment: GRM188R71C104KA01D)
C16  Voltage Rating: 6.3V  Capacitance: 47uF  [FP-1210-L_3_2_0_3-W_2_5_0-MFG]  (hidden comment: JMK325B7476KMHPR)
C17  Voltage Rating: 6.3V  Capacitance: 47uF  [FP-1210-L_3_2_0_3-W_2_5_0-MFG]  (hidden comment: JMK325B7476KMHPR)
D6  SK34A  [DIOM4325X250N]  (value not drawn)
D7  SK34A  [DIOM4325X250N]  (value not drawn)
L1  Impedance @ Frequency: 600 Ohm @ 100MHz  [L0603]  (hidden comment: MMZ1608B601C)
L2  Inductance: 3.50 µH  [WE-HCI-1890]  (hidden comment: 7443556350)
L3  Impedance @ Frequency: 220 Ohm @ 100MHz  [L0805]  (hidden comment: BLM21PG221SN1D)
L4  Impedance @ Frequency: 220 Ohm @ 100MHz  [L0805]  (hidden comment: BLM21PG221SN1D)
R13  value 100K  [RES_ERJU03J104V]  (hidden comment: ERJU03J104V)
R14  value 39k  [RESC1608X55N]  (hidden comment: ERJ-3GEYJ393V)
R15  value 10.2k  [RES_ERJ3EKF1022V]  (hidden comment: ERJ3EKF1022V)
U1  STM32F405RGT6  [STM-LQFP64_M]  (part B of 2)
U3  ADP2303ARDZ-3.3-R7  [FP-RD-8-1-IPC_A]

### Blocks framed on the sheet
MCU Power supply: C7 L1 U1
DECOUPLING CAPACITORS: C12-C15
PS DECOUPLING: C8 C9
FERRITE_FILTER: L3 L4
Switching Power Supply: C10 C11 C16 C17 D6 D7 L2 R13-R15 U3

### Nets
3V3: C8.A C9.2 C16.1 C17.1 L1.1 L2.2 L3.1 L4.1 U1.1(VBAT) U3.5(FB)
3V3_MCU: C12.1 C13.1 C14.1 C15.1 L3.2 L4.2 U1.19(VDD) U1.32(VDD) U1.48(VDD) U1.64(VDD)
COM: C7.1 C8.K C9.1 C10.1 C12.2 C13.2 C14.2 C15.2 C16.2 C17.2 D7.A R15.1 U1.12(VSSA) U1.18(VSS) U1.63(VSS) U3.7(GND)
VBATT: D6.A
BST: C11.2 U3.1(BST)
EN: R14.1 R15.2 U3.3(EN)
PGOOD: R13.2 U3.4(PGOOD)
SW: C11.1 D7.C(K) L2.1 U3.8(SW)
VDDA: C7.2 L1.2 U1.13(VDDA)
VIN: C10.2 D6.C(K) R13.1 R14.2 U3.2(VIN)

Not connected (* = marked no-connect by the designer): U3 6(NC)* 9(EP)*

### Notes on the sheet
- Mettre le cap le plus proche de la pin VIN

### Library data of the parts
C7 C12-C15 = GRM188R71C104KA01D: CAP CER 0.1UF 16V 10% X7R 0603; ComponentLink1Description: Datasheet; ComponentLink1URL: http://search.murata.co.jp/Ceramy/image/img/A01X/G101/ENG/GRM188R71C104KA01-01.pdf; ComponentLink2URL: http://media.digikey.com/photos/Murata%20Photos/0603%20Murata%20MLCC%20Caps.jpg; ComponentLink2Description: Photo; Pricing 1: 1=0.13 (USD); Tolerance: ±10%; Operating Temperature: -55°C ~ 125°C; Applications: General Purpose; Supplier 1: Digi-Key; Supplier Part Number 1: 490-1532-1-ND
  C12-C15: Temperature Coefficient: X7R; Voltage - Rated: 16V
C8 = UCL1C101MCL6GS: CAP ALUM 100UF 16V 20% SMD; Ripple Current: 600mA; Impedance: 160 mOhm; ComponentLink1Description: Datasheet; ComponentLink1URL: http://nichicon-us.com/english/products/pdfs/e-cl.pdf; ComponentLink2Description: Photo; Pricing 1: 1=0.45, 10=0.306, 100=0.144, 250=0.1026, 500=0.0783, 1000=0.054 (USD); Tolerance: ±20%; Operating Temperature: -55°C ~ 105°C; Supplier 1: Digi-Key; Supplier Part Number 1: 493-3920-1-ND
C9 = CL21B106KOQNNNE: CAP CER 10UF 16V 10% X7R 0805; ComponentLink1Description: Datasheet; ComponentLink1URL: http://www.samsungsem.com/kr/front/downloadcms.do?path=/kr/support/product-search/mlcc/__icsFiles/afieldfile/2014/11/05&fileName=C_CL21B106KOQNNNE.pdf; ComponentLink2URL: http://media.digikey.com/Renders/Samsung%20Electro-Mechanics%20America/CL%20Series%201206(3216%20Metric)%2014.jpg; ComponentLink2Description: Photo; Pricing 1: 1=0.39 (USD); Tolerance: ±10%; Temperature Coefficient: X7R; Operating Temperature: -55°C ~ 125°C; Applications: General Purpose; Supplier 1: Digi-Key; Supplier Part Number 1: 1276-2872-1-ND
C10 = CMP-2000-06106-2: CAP CER 10UF 16V X7R 0805; Manufacturer Part Number: CL21B106KOQNNNE; Manufacturer: Samsung Electro-Mechanics America, Inc; Material: Ceramic; Tolerance: 10%; Temperature Coefficient: 15%; Digikey Description: CAP CER 10UF 16V X7R 0805; Lead Free: Yes; ComponentLink2URL: http://www.samsungsem.com/servlet/FileDownload?path=productsearch&sname=CL21B106KOQNNNE.pdf&oname=CL21B106KOQNNNE.pdf; ComponentLink2Description: Datasheet; Temperature Range Low: -55°C; RoHS: TRUE; Category: Cap; Temperature Characteristic: X7R; Automotive: No; Octopart: https://octopart.com/cl21b106koqnnne-samsung-19832289; Device Class L3: Ceramic Capacitors; Temperature Range High: +125°C; Height: 1.4mm; Device Class L2: Capacitors; Value: 10uF; Temperature: -55°C to +125°C; Device Class L1: Passive Components; Ipc Land Pattern Name: CAPC200125X125; Package: CL21B106KOQNNNE
C11 = CMP-2010-01734-1: MC000311; Manufacturer: Multicomp; Part Number: MC000311
C16 = CMP-14477-003362-2: CAP CER 47UF 6.3V X7R 1210; Tolerance: 10%; Case/Package: 1210; Packaging: Cut Tape; Mount: Surface Mount; Case Code (Imperial): 1210; Max Operating Temperature: 125°C; Min Operating Temperature: -55°C; RoHS Compliant: Yes; Ratings: AEC-Q200; Case Code (Metric): 3225
C17 = CMP-14477-003362-2: None; Tolerance: 10%; Case/Package: 1210; Packaging: Cut Tape; Mount: Surface Mount; Case Code (Imperial): 1210; Max Operating Temperature: 125°C; Min Operating Temperature: -55°C; RoHS Compliant: Yes; Ratings: AEC-Q200; Case Code (Metric): 3225
L1 = MMZ1608B601C: FERRITE CHIP 600 OHM 500MA 0603; DC Resistance (DCR): 400 mOhm Max; Filter Type: Differential Mode - Single; Current Rating: 500mA; ComponentLink1URL: http://product.tdk.com/en/catalog/datasheets/beads_commercial_signal_mmz_en.pdf; ComponentLink1Description: datasheet; ComponentLink2URL: http://media.digikey.com/Renders/TDK%20Renders/MMZ1608xxxxxTAH0.jpg; ComponentLink2Description: photo; Supplier 1: Digi-Key; Supplier Part Number 1: 445-2166-1-ND
L2 = CMP-0226-00011-1: SMD Flat Wire High Current Inductor WE-HCI, L=3.50 µH; ComponentLink1URL: http://www.we-online.com; ComponentLink2Description: Datasheet; PackageVersion: 2009; PackageReference: WE-HCI-1890; ComponentLink2URL: http://www.we-online.de/katalog/media/pdf/7443556350.pdf; PackageDescription: Inductor, 2-Leads, Body 18.3 x 18.2 mm; DatasheetVersion: ver 3, Nov-2009; ComponentLink1Description: Manufacturer Link
L3 L4 = BLM21PG221SN1D: as L5 on sheet Altimiter_SCH; Supplier 1: Digi-Key; Supplier Part Number 1: 490-1054-1-ND; ComponentLink1URL: http://search.murata.co.jp/Ceramy/image/img/PDF/ENG/L0110S0100BLM21P.pdf; ComponentLink1Description: datasheet; ComponentLink2URL: http://media.digikey.com/photos/Murata%20Photos/BLM21%20SERIES%200805.jpg; ComponentLink2Description: photo
R13 = ERJU03J104V: RES 100K OHM 5% 1/10W 0603 SMD; Package: None; Price: None; Availability: Unavailable; MP: ERJU03J104V
R14 = ERJ-3GEYJ393V: Res Thick Film 0603 39K Ohm 5% 0.1W(1/10W) ?200ppm/?C Molded SMD Automotive T/R; Package: None; Price: None; MP: ERJ-3GEYJ393V; Availability: Unavailable
R15 = ERJ3EKF1022V: RES SMD 10.2K OHM 1% 1/10W 0603; Price: None; Availability: Unavailable; MP: ERJ3EKF1022V; Package: None
U1 = CMP-0243-00019-3: as U1 on sheet MCU_SCH; ComponentLink2Description: Datasheet; PackageVersion: Rev. 4, 06/2013; DatasheetVersion: Rev. 4; Core: ARM Cortex-M4; ComponentLink2URL: http://www.st.com/st-web-ui/static/active/en/resource/technical/document/datasheet/DM00037051.pdf; PackageReference: LQFP64; Packing: Tray; ComponentLink1Description: Manufacturer URL; ComponentLink3URL: http://www.st.com/st-web-ui/static/active/en/resource/technical/document/datasheet/DM00037051.pdf; ComponentLink3Description: Package Specification; Mounting Technology: Surface Mount; ComponentLink1URL: http://www.st.com/web/en/home.html; PackageDescription: 64-Pin Low Profile Quad Flat Package, 10 x 10 mm Body, 0.5 mm Pitch; PartNumber: STM32F405RGT6
U3 = CMP-09139-000634-1: IC REG BUCK 3.3V 3A 8SOIC; Operating Supply Current: 950uA; Synchronous Rectifier: No; Min Output Voltage: 800mV; Fall Time: 280ns; Output Type: Fixed; Operating Supply Voltage: 20V; Rise Time: 170ns; Output Configuration: Positive; Number of Outputs: 1; Min Input Voltage: 3V; Max Output Voltage: 16V; Switching Frequency: 700kHz; Max Duty Cycle: 50%; Series: -; Number of Pins: 8; Packaging: Tape and Reel; Mount: Surface Mount; Lead Free: Contains Lead; Min Operating Temperature: -40°C; RoHS Compliant: Yes; Radiation Hardening: No; Width: 4mm; Nominal Output Voltage: 3.3V; Contact Plating: Tin; Height: 1.75mm; Case/Package: SOIC; Max Output Current: 3A; Max Operating Temperature: 125°C; Length: 4.9mm; Max Input Voltage: 20V; Output Voltage: 3.3V; Output Current: 3A; Nominal Supply Current: 950uA; Weight: 0.019048oz
D6 D7 = SK34A: Price: None; Availability: Unavailable; Value: *; MP: SK34A; Package: None

## Sheet Ejection_SCH.SchDoc
size A; SheetNumber: 7; SheetTotal: 9
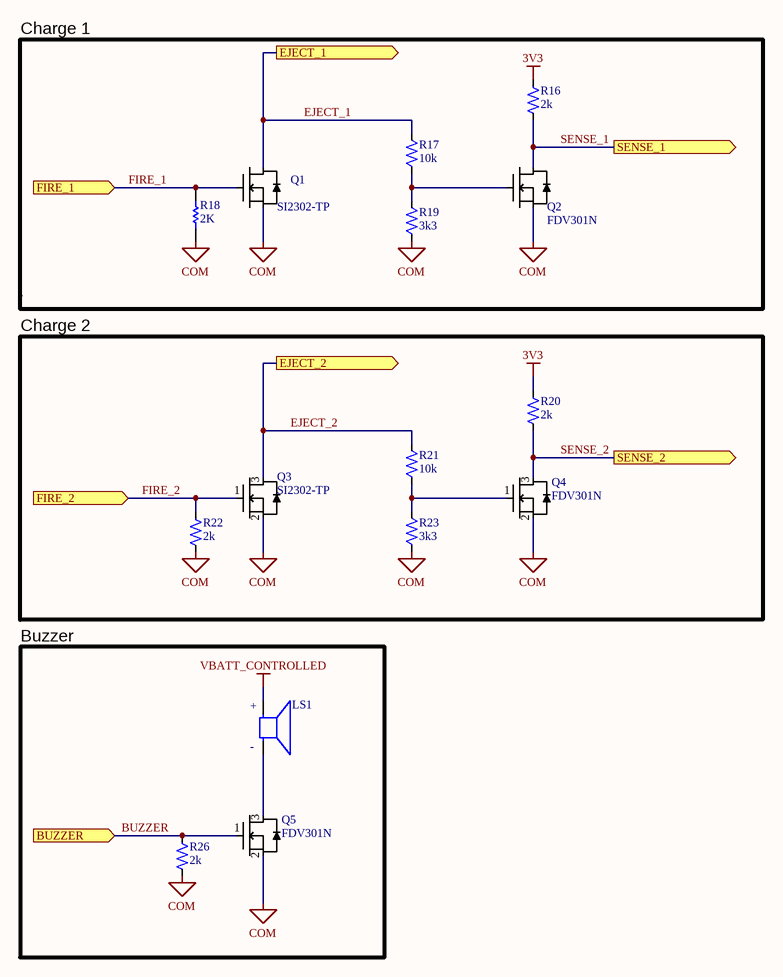
[diagram p6: Ejection_SCH.SchDoc]

### Parts
LS1  AT-1224-TWT-12V-2-R  [XDCR_AT-1224-TWT-12V-2-R]  (value not drawn)
Q1  SI2302-TP  [SOT-23-3]
Q2  FDV301N  [SOT-23-3]
Q3  SI2302-TP  [SOT-23-3]
Q4  FDV301N  [SOT-23-3]
Q5  FDV301N  [SOT-23-3]
R16  Resistance (Ohms): 2k  [R0603]  (hidden comment: ERJ-3GEYJ202V)
R17  Resistance (Ohms): 10k  [R0603]  (hidden comment: ERJ-3GEYJ103V)
R18  2K  [RESC1608X55X30LL15T15]
R19  Resistance (Ohms): 3k3  [R0603]  (hidden comment: ERJ-3EKF3301V)
R20  Resistance (Ohms): 2k  [R0603]  (hidden comment: ERJ-3GEYJ202V)
R21  Resistance (Ohms): 10k  [R0603]  (hidden comment: ERJ-3GEYJ103V)
R22  Resistance (Ohms): 2k  [R0603]  (hidden comment: ERJ-3GEYJ202V)
R23  Resistance (Ohms): 3k3  [R0603]  (hidden comment: ERJ-3EKF3301V)
R26  Resistance (Ohms): 2k  [R0603]  (hidden comment: ERJ-3GEYJ202V)

### Blocks framed on the sheet
Charge 1: Q1 Q2 R16-R19
Charge 2: Q3 Q4 R20-R23
Buzzer: LS1 Q5 R26

### Ports
BUZZER (in), EJECT_1 (out), EJECT_2 (out), FIRE_1 (in), FIRE_2 (in), SENSE_1 (out), SENSE_2 (out)

### Nets
3V3: R16.1 R20.1
COM: Q1.2(S) Q2.2(S) Q3.2(S) Q4.2(S) Q5.2(S) R18.1 R19.1 R22.2 R23.1 R26.2
VBATT_CONTROLLED: LS1.P
BUZZER: Q5.1(G) R26.1 ; port BUZZER
EJECT_1: Q1.3(D) R17.2 ; port EJECT_1
EJECT_2: Q3.3(D) R21.2 ; port EJECT_2
FIRE_1: Q1.1(G) R18.2 ; port FIRE_1
FIRE_2: Q3.1(G) R22.1 ; port FIRE_2
SENSE_1: Q2.3(D) R16.2 ; port SENSE_1
SENSE_2: Q4.3(D) R20.2 ; port SENSE_2
NetLS1_N: LS1.N Q5.3(D)
NetQ2_1: Q2.1(G) R17.1 R19.2
NetQ4_1: Q4.1(G) R21.1 R23.2

### Notes on the sheet
- (near Q3) Trouver une plus petite mossfet
- (in symbol AT-1224-TWT-12V-2-R) +; -

### Library data of the parts
LS1 = AT-1224-TWT-12V-2-R: AUDIO TRANSDUCER 12 VP-P 85 DB 2400 HZ; MF: PUI Audio,; Package: PUI Audio,; MP: AT-1224-TWT-12V-2-R; Purchase-URL: https://pricing.snapeda.com/search/part/AT-1224-TWT-12V-2-R/?ref=eda; SnapEDA_Link: https://www.snapeda.com/parts/AT-1224-TWT-12V-2-R/PUI%20Audio,%20Inc./view-part/3215877/?ref=snap; Check_prices: https://www.snapeda.com/parts/AT-1224-TWT-12V-2-R/PUI%20Audio,%20Inc./view-part/3215877/?ref=eda; Price: None; Value: *; Availability: In Stock
Q1 Q3 = FDV301N: MOSFET N-CH 20V 3A SOT-23; Manufacturer: Fairchild Semiconductor; FET Type: MOSFET N-Channel, Metal Oxide; FET Feature: Logic Level Gate; Drain to Source Voltage (Vdss): 25V; Current - Continuous Drain (Id) @ 25°C: 220mA (Ta); Rds On (Max) @ Id, Vgs: 4 Ohm @ 400mA, 4.5V; Vgs(th) (Max) @ Id: 1.06V @ 250µA; Gate Charge (Qg) @ Vgs: 0.7nC @ 4.5V; Input Capacitance (Ciss) @ Vds: 9.5pF @ 10V; Power - Max: 350mW; ComponentLink1Description: Datasheet; ComponentLink1URL: https://www.fairchildsemi.com/datasheets/FD/FDV301N.pdf; ComponentLink2URL: http://media.digikey.com/Renders/~~Pkg.Case%20or%20Series/SOT-23-3%20PKG.jpg; ComponentLink2Description: Photo; Pricing 1: 1=0.31 (CAN); Supplier 1: Digi-Key; Supplier Part Number 1: FDV301NCT-ND
Q2 Q4 Q5 = FDV301N: MOSFET N-CH 25V 220MA SOT-23; Manufacturer: Fairchild Semiconductor; FET Type: MOSFET N-Channel, Metal Oxide; FET Feature: Logic Level Gate; Current - Continuous Drain (Id) @ 25°C: 220mA (Ta); Rds On (Max) @ Id, Vgs: 4 Ohm @ 400mA, 4.5V; Vgs(th) (Max) @ Id: 1.06V @ 250µA; Gate Charge (Qg) @ Vgs: 0.7nC @ 4.5V; Input Capacitance (Ciss) @ Vds: 9.5pF @ 10V; Power - Max: 350mW; ComponentLink1Description: Datasheet; ComponentLink1URL: https://www.fairchildsemi.com/datasheets/FD/FDV301N.pdf; ComponentLink2URL: http://media.digikey.com/Renders/~~Pkg.Case%20or%20Series/SOT-23-3%20PKG.jpg; ComponentLink2Description: Photo; Pricing 1: 1=0.31 (CAN); Drain to Source Voltage (Vdss): 25V; Supplier 1: Digi-Key; Supplier Part Number 1: FDV301NCT-ND
R16 R20 R22 R26 = ERJ-3GEYJ202V: RES SMD 2K OHM 5% 1/10W 0603; Temperature Coefficient: ±200ppm/°C; Power (Watts): 0.1W, 1/10W; ComponentLink1Description: Datasheet; ComponentLink1URL: http://industrial.panasonic.com/www-cgi/jvcr13pz.cgi?E+PZ+3+AOA0001+ERJ3GEYJ223V+7+WW; ComponentLink2URL: http://media.digikey.com/photos/Panasonic%20Photos/10-0603%20Resistor.jpg; ComponentLink2Description: Photo; Tolerance: ±5%; Composition: Thick Film; Operating Temperature: -55°C ~ 155°C; Supplier 1: Digi-Key; Supplier Part Number 1: P2.0KGCT-ND
R17 R21 = ERJ-3GEYJ103V: RES SMD 10K OHM 5% 1/10W 0603; Temperature Coefficient: ±200ppm/°C; Power (Watts): 0.1W, 1/10W; ComponentLink1Description: Datasheet; ComponentLink1URL: http://industrial.panasonic.com/www-cgi/jvcr13pz.cgi?E+PZ+3+AOA0001+ERJ3GEYJ223V+7+WW; ComponentLink2URL: http://media.digikey.com/photos/Panasonic%20Photos/10-0603%20Resistor.jpg; ComponentLink2Description: Photo; Tolerance: ±5%; Composition: Thick Film; Operating Temperature: -55°C ~ 155°C; Supplier 1: Digi-Key; Supplier Part Number 1: P10KGCT-ND
R18 = CMP-2000-00741-1: RES SMD 2K OHM 5% 1/10W 0603; Part Number: ERJ-3GEYJ202V; Manufacturer: Panasonic
R19 R23 = ERJ-3EKF3301V: RES SMD 3.3K OHM 1% 1/10W 0603; Temperature Coefficient: ±100ppm/°C; Power (Watts): 0.1W; ComponentLink1Description: Datasheet; ComponentLink1URL: http://industrial.panasonic.com/www-cgi/jvcr13pz.cgi?E+PZ+3+AOA0002+ERJ3EKF51R1V+7+WW; ComponentLink2URL: http://media.digikey.com/Renders/Panasonic%20Renders/ERJ-1206%20Pkg.jpg; ComponentLink2Description: Photo; Tolerance: ±1%; Composition: Thick Film; Operating Temperature: -55°C ~ 155°C; Supplier 1: Digi-Key; Supplier Part Number 1: P3.30KHCT-ND

## Sheet IMU_SCH.SchDoc
size A; SheetNumber: 7; SheetTotal: 8
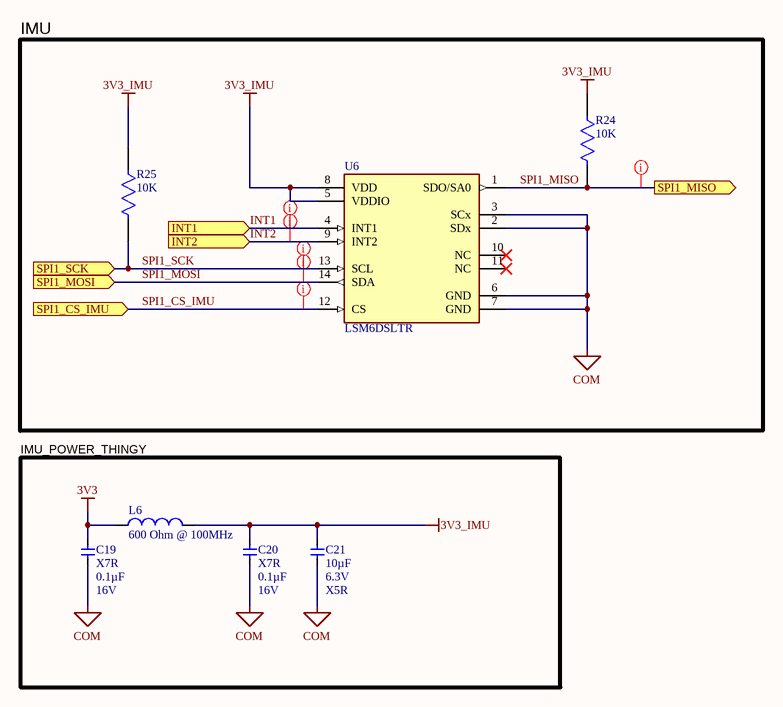
[diagram p7: IMU_SCH.SchDoc]

### Parts
C19  Temperature Coefficient: X7R  Capacitance: 0.1µF  Voltage - Rated: 16V  [C0603]  (hidden comment: GRM188R71C104KA01D)
C20  Temperature Coefficient: X7R  Capacitance: 0.1µF  Voltage - Rated: 16V  [C0603]  (hidden comment: GRM188R71C104KA01D)
C21  Capacitance: 10µF  Voltage - Rated: 6.3V  Temperature Coefficient: X5R  [C0603]  (hidden comment: GRM188R60J106ME47D)
L6  Impedance @ Frequency: 600 Ohm @ 100MHz  [L0603]  (hidden comment: MMZ1608B601C)
R24  10K  [FP-ERJ3G-IPC_C]
R25  10K  [FP-ERJ3G-IPC_C]
U6  LSM6DSLTR  [FP-LGA-14L-DM00249496-MFG]

### Blocks framed on the sheet
IMU: R24 R25 U6
IMU_POWER_THINGY: C19-C21 L6

### Ports
INT1 (in), INT2 (in), SPI1_CS_IMU (in), SPI1_MISO (out), SPI1_MOSI (in), SPI1_SCK (in)

### Nets
3V3: C19.2 L6.1
3V3_IMU: C20.2 C21.2 L6.2 R24.1 R25.1 U6.5(VDDIO) U6.8(VDD)
COM: C19.1 C20.1 C21.1 U6.2(SDx) U6.3(SCx) U6.6(GND) U6.7(GND)
INT1: U6.4(INT1) ; port INT1
INT2: U6.9(INT2) ; port INT2
SPI1_CS_IMU: U6.12(CS) ; port SPI1_CS_IMU
SPI1_MISO: R24.2 U6.1(SDO/SA0) ; port SPI1_MISO
SPI1_MOSI: U6.14(SDA) ; port SPI1_MOSI
SPI1_SCK: R25.2 U6.13(SCL) ; port SPI1_SCK

Not connected (* = marked no-connect by the designer): U6 10(NC)* 11(NC)*

### Layout directives
net class 50_Ohm: INT1, INT2, SPI1_CS_IMU, SPI1_MISO, SPI1_MOSI, SPI1_SCK

### Library data of the parts
C19 C20 = GRM188R71C104KA01D: CAP CER 0.1UF 16V 10% X7R 0603; ComponentLink1Description: Datasheet; ComponentLink1URL: http://search.murata.co.jp/Ceramy/image/img/A01X/G101/ENG/GRM188R71C104KA01-01.pdf; ComponentLink2URL: http://media.digikey.com/photos/Murata%20Photos/0603%20Murata%20MLCC%20Caps.jpg; ComponentLink2Description: Photo; Pricing 1: 1=0.13 (USD); Tolerance: ±10%; Operating Temperature: -55°C ~ 125°C; Applications: General Purpose; Supplier 1: Digi-Key; Supplier Part Number 1: 490-1532-1-ND
C21 = GRM188R60J106ME47D: CAP CER 10UF 6.3V X5R 0603; Manufacturer: Murata Electronics North America; Tolerance: ±20%; Supplier 1: Digi-Key; Supplier Part Number 1: 490-3896-1-ND; Manufacturer Part Number: GRM188R60J106ME47D; RoHS: RoHS Compliant; Category: Capacitors; Stock 1: 3077943; Pricing 1: 1=0.28, 10=0.186, 50=0.1124, 100=0.0944, 250=0.0764, 500=0.0674, 1000=0.0573 (CAD); Packaging: Cut Tape (CT); Mounting Type: Surface Mount, MLCC; Operating Temperature: -55°C ~ 85°C; Applications: General Purpose; Ratings: -; Package / Case: 0603 (1608 Metric); Size / Dimension: 0.063" L x 0.031" W (1.60mm x 0.80mm); Height - Seated (Max): -; Thickness (Max): 0.035" (0.90mm); Lead Spacing: -; Features: -; Lead Style: -; ComponentLink1URL: http://www.murata.com/~/media/webrenewal/support/library/catalog/products/capacitor/mlcc/c02e.ashx; ComponentLink1Description: http://www.murata.com/~/media/webrenewal/support/library/catalog/products/capacitor/mlcc/c02e.ashx
L6 = MMZ1608B601C: as L1 on sheet PCU_SCH; Current Rating: 500mA; ComponentLink1URL: http://product.tdk.com/en/catalog/datasheets/beads_commercial_signal_mmz_en.pdf; ComponentLink1Description: datasheet; ComponentLink2URL: http://media.digikey.com/Renders/TDK%20Renders/MMZ1608xxxxxTAH0.jpg; ComponentLink2Description: photo; Supplier 1: Digi-Key; Supplier Part Number 1: 445-2166-1-ND
R24 R25 = CMP-2000-00704-2: as R2 on sheet MCU_SCH; Resistor Type: Thick Film; Tolerance: 5%; Military Standard: Not; Package Quantity: 1; Max Operating Temperature: 155°C; Mount: Surface Mount; Technology: THICK FILM; Case/Package: 0603; Construction: Rectangular; Depth: 0.8mm; Case Code (Imperial): 0603; Weight: 7.1E-05oz; Features: Automotive AEC-Q200; Packaging: Tape and Reel; Width: 0.8mm; Length: 1.6mm; Termination: SMD/SMT; Power Rating: 100mW; Lead Free: Lead Free; Number of Terminations: 2; Height: 0.45mm; RoHS Compliant: Yes; Min Operating Temperature: -55°C; Contact Plating: Tin; REACH SVHC: No SVHC; Resistance Tolerance: 5%; Series: ERJ; Working Voltage: 75V; Case Code (Metric): 1608
U6 = CMP-2000-07467-2: IMU ACCEL/GYRO I2C/SPI 14LGA; Manufacturer: STMicroelectronics; Resolution: 16bits; Max Supply Voltage: 3.6V; Sensor Type: Temperature,Accelerometer,Gyroscope; Sensor Output: I2C,SPI; Gyro Range: 125/250/500/1000/2000°/s; Accel Range: 2/4/8/16g; Operating Supply Current: 0.29-0.65mA; Min Supply Voltage: 1.62V; Package: LGA-14L-DM00249496; Temperature Range High: +85°C; Automotive: No; Footprint Url: https://www.st.com/resource/en/technical_note/cd00134799.pdf; Height: 0.86mm; Device Class L1: Sensors; Octopart: https://octopart.com/lsm6dsltr-stmicroelectronics-66358193; Device Class L2: Motion Sensors; Lead Free: Yes; Category: IC; Device Class L3: Inertial Measurement Units (IMUs); ComponentLink2Description: Datasheet; RoHS: TRUE; ComponentLink2URL: https://www.st.com/resource/en/datasheet/lsm6dsl.pdf; Temperature Range Low: -40°C; Manufacturer Part Number: LSM6DSLTR; Mouser Description: iNEMO inertial module: always-on 3D accelerometer and 3D gyroscope; Digikey Description: IMU ACCEL/GYRO I2C/SPI 14LGA; Temperature: -40°C to +85°C